# Altium project DRLPWM555.PrjPCB
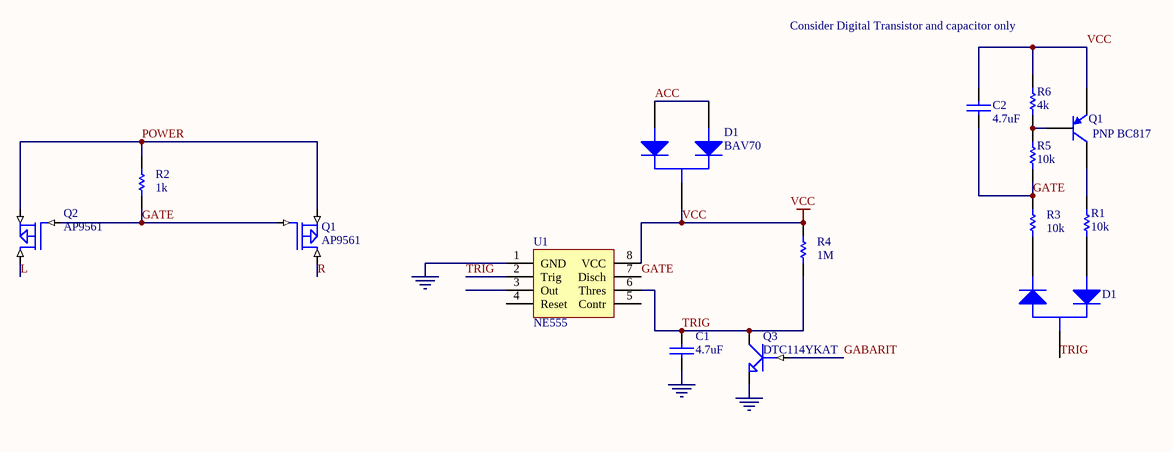
[diagram p0: DRLPWM555.SchDoc]
1 sheet, 15 parts. Net scope: global (net labels, ports and power ports of the same name join across sheets).
Board file: DRLPWM555.PcbDoc

## Sheet DRLPWM555.SchDoc
size A4

### Parts
(Parts that share a designator on the sheet are numbered #1, #2 ... from top to bottom, then left to right.)
C1  4.7uF  [0805]
C2  4.7uF  [0805]
D1#1  BAV70  [SOT-23]
D1#2  BAV99  [SOT-23]  (value not drawn)
Q1#1  PNP BC817  [sot-23]
Q1#2  AP9561  [D-Pack]
Q2  AP9561  [D-Pack]
Q3  DTC114YKAT  [SOT-23]
R1  10k  [0805]
R2  1k  [1206]
R3  10k  [0805]
R4  1M  [0805]
R5  10k  [0805]
R6  4k  [0805]
U1  NE555  [SO-8]

### Nets
PGND: C1.2 Q3.3(E) U1.1(GND)
VCC: C2.2 D1#1.2(K) Q1#1.3(E) R4.1 R6.1 U1.8(VCC)
ACC: D1#1.1(A1) D1#1.3(A2)
GABARIT: Q3.1(B)
GATE: C2.1 Q1#2.1(GATE) Q2.1(GATE) R2.2 R3.1 R5.1 U1.7(Disch)
L: Q2.2(DRAIN)
POWER: Q1#2.3(SOURCE) Q2.3(SOURCE) R2.1
R: Q1#2.2(DRAIN)
TRIG: C1.1 D1#2.2(AK) Q3.2(C) R4.2 U1.2(Trig) U1.6(Thres)
NetD1#2_1: D1#2.1(A) R1.1
NetD1#2_3: D1#2.3(K) R3.2
NetQ1#1_1: Q1#1.1(B) R5.2 R6.2
NetQ1#1_2: Q1#1.2(C) R1.2

Not connected (* = marked no-connect by the designer): U1 3(Out) 4(Reset) 5(Contr)

### Notes on the sheet
- Consider Digital Transistor and capacitor only

### Library data of the parts
C1 C2 = CAP: Capacitor
D1#1 = DUAL DIODE BAV70
D1#2 = DUAL DIODE BAV99
Q1#1 = PNP: PNP Bipolar Transistor; Manufacturer: Generic Components; Class: Discrete; SubClass: BJT - Low Power; Published: 08/06/2000; Publisher: Altium Hobart Technology Centre
Q1#2 Q2 = MOSFET P
Q3 = NPN1: NPN Transistor
R1-R6 = Res1: Resistor; Manufacturer: Generic Components; Class: Passive; Value: 4k7; Published: 08/06/2000; Publisher: Altium Hobart Technology Centre; SubClass: Resistor
U1 = NE555: Timer 555